# EAGLE design current_monitor_1_0_0 (EAGLE 6.1)
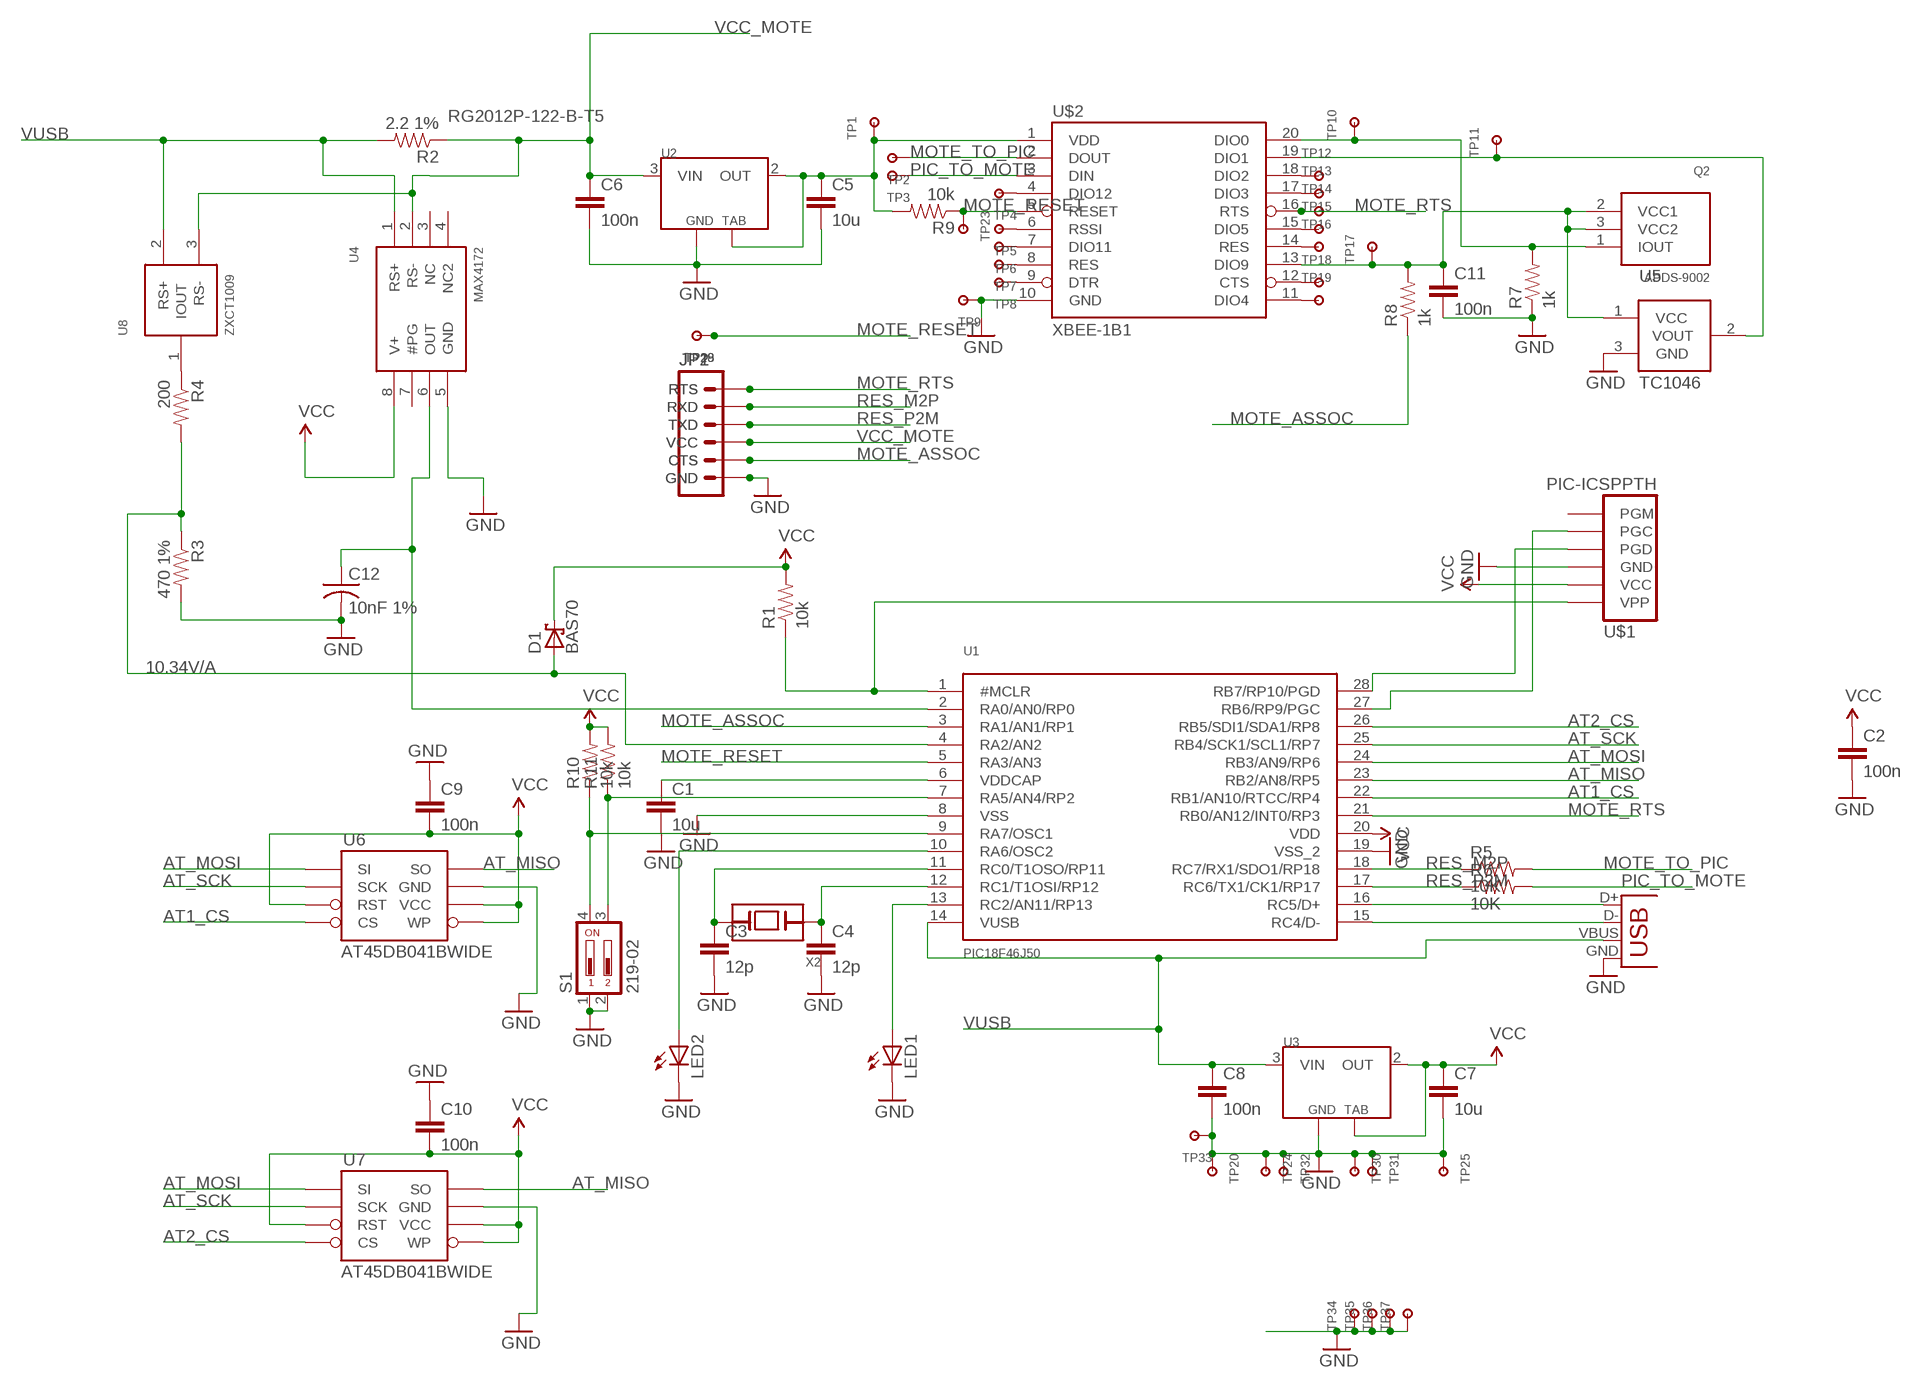
[diagram p0: schematic, sheet 1]

## Parts
C1  10u  CAP0805  [0805]
C2  100n  CAP0805  [0805]
C3  12p  CAP0805  [0805]
C4  12p  CAP0805  [0805]
C5  10u  CAP0805  [0805]
C6  100n  CAP0805  [0805]
C7  10u  CAP0805  [0805]
C8  100n  CAP0805  [0805]
C9  100n  CAP0805  [0805]
C10  100n  CAP0805  [0805]
C11  100n  CAP0805  [0805]
C12  10nF 1%  C-USC1812  [C1812]
D1  BAS70  [SOT23]
JP1  FTDI_CABLESIP  [1X06]
JP2  FTDI_CABLESIP  [1X06]
LED1  LEDCHIP-LED0805  [CHIP-LED0805]
LED2  LEDCHIP-LED0805  [CHIP-LED0805]
Q2  APDS-9002  [APDS-9002]
R1  10k  RESISTOR  [0805]
R2  2.2 1%  RESISTOR  [0805]
R3  470 1%  RESISTOR  [0805]
R4  200  RESISTOR  [0805]
R5  10K  RESISTOR  [0805]
R6  10K  RESISTOR  [0805]
R7  1k  RESISTOR  [0805]
R8  1k  RESISTOR  [0805]
R9  10k  RESISTOR  [0805]
R10  10k  RESISTOR  [0805]
R11  10k  RESISTOR  [0805]
S1  219-02  [CTS-219-02]
TP1  TESTPOINT100MIL  [TESTPOINT-100MIL]
TP2  TESTPOINT100MIL  [TESTPOINT-100MIL]
TP3  TESTPOINT100MIL  [TESTPOINT-100MIL]
TP4  TESTPOINT100MIL  [TESTPOINT-100MIL]
TP5  TESTPOINT100MIL  [TESTPOINT-100MIL]
TP6  TESTPOINT100MIL  [TESTPOINT-100MIL]
TP7  TESTPOINT100MIL  [TESTPOINT-100MIL]
TP8  TESTPOINT100MIL  [TESTPOINT-100MIL]
TP9  TESTPOINT100MIL  [TESTPOINT-100MIL]
TP10  TESTPOINT100MIL  [TESTPOINT-100MIL]
TP11  TESTPOINT100MIL  [TESTPOINT-100MIL]
TP12  TESTPOINT100MIL  [TESTPOINT-100MIL]
TP13  TESTPOINT100MIL  [TESTPOINT-100MIL]
TP14  TESTPOINT100MIL  [TESTPOINT-100MIL]
TP15  TESTPOINT100MIL  [TESTPOINT-100MIL]
TP16  TESTPOINT100MIL  [TESTPOINT-100MIL]
TP17  TESTPOINT100MIL  [TESTPOINT-100MIL]
TP18  TESTPOINT100MIL  [TESTPOINT-100MIL]
TP19  TESTPOINT100MIL  [TESTPOINT-100MIL]
TP20  TESTPOINTSMALLEST  [TESTPOINT]
TP23  TESTPOINT100MIL  [TESTPOINT-100MIL]
TP24  TESTPOINTSMALLEST  [TESTPOINT]
TP25  TESTPOINTSMALLEST  [TESTPOINT]
TP28  TESTPOINT100MIL  [TESTPOINT-100MIL]
TP29  TESTPOINT100MIL  [TESTPOINT-100MIL]
TP30  TESTPOINTSMALLEST  [TESTPOINT]
TP31  TESTPOINTSMALLEST  [TESTPOINT]
TP32  TESTPOINTSMALLEST  [TESTPOINT]
TP33  TESTPOINTSMALLEST  [TESTPOINT]
TP34  TESTPOINTM3  [M3_HOLE]
TP35  TESTPOINTM3  [M3_HOLE]
TP36  TESTPOINTM3  [M3_HOLE]
TP37  TESTPOINTM3  [M3_HOLE]
U1  PIC18F46J50  [SO28W]
U2  NX1117C  [SOT223]
U3  NX1117C  [SOT223]
U4  MAX4172  [SO08]
U5  TC1046  [SOT23]
U6  AT45DB041BWIDE  [SO08WIDE]
U7  AT45DB041BWIDE  [SO08WIDE]
U8  ZXCT1009  [SOT23]
U$1  PIC-ICSPPTH  [MOLEX-1X6]
U$2  XBEE-1B1  [XBEE-1]
X1  USBSMD  [USB-MINIB]
X2  XTALABS07  [ABS07]

## Nets
AT1_CS: U1.22(RB1/AN10/RTCC/RP4) U6.4(CS)
AT2_CS: U1.26(RB5/SDI1/SDA1/RP8) U7.4(CS)
AT_MISO: U1.23(RB2/AN8/RP5) U6.8(SO) U7.8(SO)
AT_MOSI: U1.24(RB3/AN9/RP6) U6.1(SI) U7.1(SI)
AT_SCK: U1.25(RB4/SCK1/SCL1/RP7) U6.2(SCK) U7.2(SCK)
EXTRA1: R11.1 S1.3 U1.7(RA5/AN4/RP2)
EXTRA2: R10.1 S1.4 U1.9(RA7/OSC1)
EXTRA3: LED2.A U1.10(RA6/OSC2)
GND [POWER]: C1.2 C2.2 C3.2 C4.2 C5.2 C6.2 C7.2 C8.2 C9.1 C10.1 C11.2 C12.2 JP1.1(GND) JP2.1(GND) LED1.C LED2.C R3.2 R7.1 S1.1 S1.2 TP9.2 TP20.P$1 TP24.P$1 TP25.P$1 TP30.P$1 TP31.P$1 TP32.P$1 TP33.P$1 TP34.P$1 TP35.P$1 TP36.P$1 TP37.P$1 U1.8(VSS) U1.19(VSS_2) U2.1(GND) U3.1(GND) U4.5(GND) U5.3(GND) U6.7(GND) U7.7(GND) U$1.4(GND) U$2.10(GND) X1.GND
MOTE_ASSOC: JP1.2(CTS) JP2.2(CTS) R8.1 U1.3(RA1/AN1/RP1)
MOTE_RESET: R9.1 TP23.2 TP28.2 TP29.2 U1.5(RA3/AN3) U$2.5(RESET)
MOTE_RTS: JP1.6(RTS) JP2.6(RTS) TP14.2 U1.21(RB0/AN12/INT0/RP3) U$2.16(RTS)
MOTE_TO_PIC: R5.2 TP2.2 U$2.2(DOUT)
N$1 [USB]: U1.16(RC5/D+) X1.D+
N$2 [USB]: U1.15(RC4/D-) X1.D-
N$3: LED1.A U1.13(RC2/AN11/RP13)
N$4: C1.1 U1.6(VDDCAP)
N$5: R1.1 U1.1(#MCLR) U$1.6(VPP)
N$6: C4.1 U1.12(RC1/T1OSI/RP12) X2.1(A)
N$7: C3.1 U1.11(RC0/T1OSO/RP11) X2.2(B)
N$8: U1.28(RB7/RP10/PGD) U$1.3(PGD)
N$9: U1.27(RB6/RP9/PGC) U$1.2(PGC)
N$10 [POWER]: C5.1 R9.2 TP1.2 U2.2(OUT) U2.4(TAB) U$2.1(VDD)
N$11: C12.1 U1.2(RA0/AN0/RP0) U4.6(OUT)
N$12: D1.1(A) R3.1 R4.2 U1.4(RA2/AN2)
N$13: R4.1 U8.1(IOUT)
N$15: C11.1 Q2.2(VCC1) Q2.3(VCC2) R8.2 TP17.2 U5.1(VCC) U$2.13(DIO9)
N$16: Q2.1(IOUT) R7.2 TP10.2 U$2.20(DIO0)
N$17: TP11.2 U5.2(VOUT) U$2.19(DIO1)
N$22: TP4.2 U$2.4(DIO12)
N$23: TP5.2 U$2.6(RSSI)
N$24: TP6.2 U$2.7(DIO11)
N$25: TP7.2 U$2.8(RES)
N$26: TP8.2 U$2.9(DTR)
N$27: TP12.2 U$2.18(DIO2)
N$28: TP13.2 U$2.17(DIO3)
N$30: TP15.2 U$2.15(DIO5)
N$31: TP16.2 U$2.14(RES)
N$32: TP18.2 U$2.12(CTS)
N$33: TP19.2 U$2.11(DIO4)
PIC_TO_MOTE: R6.2 TP3.2 U$2.3(DIN)
RES_M2P: JP1.5(RXD) JP2.5(RXD) R5.1 U1.18(RC7/RX1/SDO1/RP18)
RES_P2M: JP1.4(TXD) JP2.4(TXD) R6.1 U1.17(RC6/TX1/CK1/RP17)
VCC: C2.1 C7.1 C9.2 C10.2 D1.3(C) R1.2 R10.2 R11.2 U1.20(VDD) U3.2(OUT) U3.4(TAB) U4.8(V+) U6.3(RST) U6.5(WP) U6.6(VCC) U7.3(RST) U7.5(WP) U7.6(VCC) U$1.5(VCC)
VCC_MOTE [POWER]: C6.1 JP1.3(VCC) JP2.3(VCC) R2.1 U2.3(VIN) U4.2(RS-) U8.3(RS-)
VUSB [POWER]: C8.1 R2.2 U1.14(VUSB) U3.3(VIN) U4.1(RS+) U8.2(RS+) X1.VBUS
Unconnected: U4.3(NC) U4.4(NC2) U4.7(#PG) U$1.1(PGM)

## Notes on the sheet
- RG2012P-122-B-T5
- 10.34V/A

## Library data of the parts
C1-C11 = SparkFun:CAP: Capacitor Standard 0603 ceramic capacitor, and 0.1" leaded capacitor.
C12 = rcl:C-US: CAPACITOR, American symbol
D1 = diode:BAS70: Silicon Schottky Diodes General-purpose diode for high-speed switching
JP1 JP2 = custom:FTDI_CABLE: Header 6 Standard 6-pin 0.1" header. Use with straight break away headers (SKU : PRT-00116), right angle break away headers (PRT-00553), swiss pins (PRT-00743), machine pins (PRT-00117), and female headers (PRT-00115). Molex polarized connector foot print use with SKU : PRT-08094 with associated crimp pins and housings. NOTES ON THE VARIANTS LOCK and LOCK_LONGPADS... This footprint was designed to help hold the alignment of a through-hole component (i.e. 6-pin header) while soldering it into place. You may notice that each hole has been shifted either up or down by 0.005 of an inch from it's more standard position (which is a perfectly straight line). This slight alteration caused the pins (the squares in the middle) to touch the edges of the holes. Because they are alternating, it causes a "brace" to hold the component in place. 0.005 has proven to be the perfect amount of "off-center" position when using our standard breakaway headers. Although looks a little odd when you look at the bare footprint, once you have a header in there, the alteration is very hard to notice. Also, if you push a header all the way into place, it is covered up entirely on the bottom side. This idea of altering the position of holes to aid alignment will be further integrated into the Sparkfun Library for other footprints. It can help hold any component with 3 or more connection pins.
LED1 LED2 = led:LED: LED OSRAM: - CHIPLED LG R971, LG N971, LY N971, LG Q971, LY Q971, LO R971, LY R971 LH N974, LH R974 LS Q976, LO Q976, LY Q976 LO Q996 - Hyper CHIPLED LW Q18S LB Q993, LB Q99A, LB R99A - SideLED LS A670, LO A670, LY A670, LG A670, LP A670 LB A673, LV A673, LT A673, LW A673 LH A674 LY A675 LS A676, LA A676, LO A676, LY A676, LW A676 LS A679, LY A679, LG A679 - Hyper Micro SIDELED® LS Y876, LA Y876, LO Y876, LY Y876 LT Y87S - SmartLED LW L88C, LW L88S LB L89C, LB L89S, LG L890 LS L89K, LO L89K, LY L89K LS L896, LA L896, LO L896, LY L896 - TOPLED LS T670, LO T670, LY T670, LG T670, LP T670 LSG T670, LSP T670, LSY T670, LOP T670, LYG T670 LG T671, LOG T671, LSG T671 LB T673, LV T673, LT T673, LW T673 LH T674 LS T676, LA T676, LO T676, LY T676, LB T676, LH T676, LSB T676, LW T676 LB T67C, LV T67C, LT T67C, LS T67K, LO T67K, LY T67K, LW E67C LS E67B, LA E67B, LO E67B, LY E67B, LB E67C, LV E67C, LT E67C LW T67C LS T679, LY T679, LG T679 LS T770, LO T770, LY T770, LG T770, LP T770 LB T773, LV T773, LT T773, LW T773 LH T774 LS E675, LA E675, LY E675, LS T675 LS T776, LA T776, LO T776, LY T776, LB T776 LHGB T686 LT T68C, LB T68C - Hyper Mini TOPLED® LB M676 - Mini TOPLED Santana® LG M470 LS M47K, LO M47K, LY M47K Source: http://www.osram.convergy.de LUXEON: - LUMILED® LXK2-PW12-R00, LXK2-PW12-S00, LXK2-PW14-U00, LXK2-PW14-V00 LXK2-PM12-R00, LXK2-PM12-S00, LXK2-PM14-U00 LXK2-PE12-Q00, LXK2-PE12-R00, LXK2-PE12-S00, LXK2-PE14-T00, LXK2-PE14-U00 LXK2-PB12-K00, LXK2-PB12-L00, LXK2-PB12-M00, LXK2-PB14-N00, LXK2-PB14-P00, LXK2-PB14-Q00 LXK2-PR12-L00, LXK2-PR12-M00, LXK2-PR14-Q00, LXK2-PR14-R00 LXK2-PD12-Q00, LXK2-PD12-R00, LXK2-PD12-S00 LXK2-PH12-R00, LXK2-PH12-S00 LXK2-PL12-P00, LXK2-PL12-Q00, LXK2-PL12-R00 Source: www.luxeon.com KINGBRIGHT: KA-3528ASYC Source: www.kingbright.com
Q2 = WSNlib:APDS-9002: APDS-9002 Ambient Light to Current Sensor
R1-R11 = SparkFun:RESISTOR: Resistor Basic schematic elements and footprints for 0603, 1206, and PTH 1/10th watt (small) resistors.
S1 = switch-dil:219-02*: Surface Mount DIP Switch Series 219 SMT CTS Electronic Components Sourc: www.ctscorp.com
TP1-TP20 TP23-TP25 TP28-TP37 = WSNlib:TESTPOINT: Generic Testpoint
U1 = WSNlib:PIC18F46J50: PIC18F46J50 USB Microcontroller w/ RTC http://ww1.microchip.com/downloads/en/DeviceDoc/39931d.pdf
U2 U3 = WSNlib:NX1117C: NX1117C LDO Voltage regulator 1A
U4 = WSNlib:MAX4172: MAX4172 Current sense current output amplifier http://datasheets.maxim-ic.com/en/ds/MAX4172.pdf
U5 = WSNlib:TC1046: TC1046 Temperature Sensor Microchip Technologies
U6 U7 = SparkFun:AT45DB041B
U8 = WSNlib:ZXCT1009: ZXCT1009 Current Monitor (current output) http://www.diodes.com/zetex/_pdfs/3.0/pdf/ZXCT1009.pdf
U$1 = SparkFun:PIC-ICSP: ISCP Programming connector for UAV, UBW Kit, etc.
U$2 = SparkFun:XBEE-1
X1 = SparkFun:USB: USB Connectors USB-B-PTH is fully proven SKU : PRT-00139 USB-miniB is fully proven SKU : PRT-00587 USB-A-PCB is untested. USB-A-H is throughly reviewed, but untested. Spark Fun Electronics SKU : PRT-00437 USB-B-SMT is throughly reviewed, but untested. Needs silkscreen touching up. USB-A-S has not been used/tested USB-MB-H has not been used/tested
X2 = WSNlib:XTAL: Crystals used in OpenMote

## Net classes
0 default: width 0.305 mm, drill 0.33 mm, clearance 0.203 mm
1 POWER: width 0.61 mm, drill 0.508 mm, clearance 0.254 mm
2 USB: width 0.305 mm, drill 25.4 mm, clearance 0.203 mm

## Board
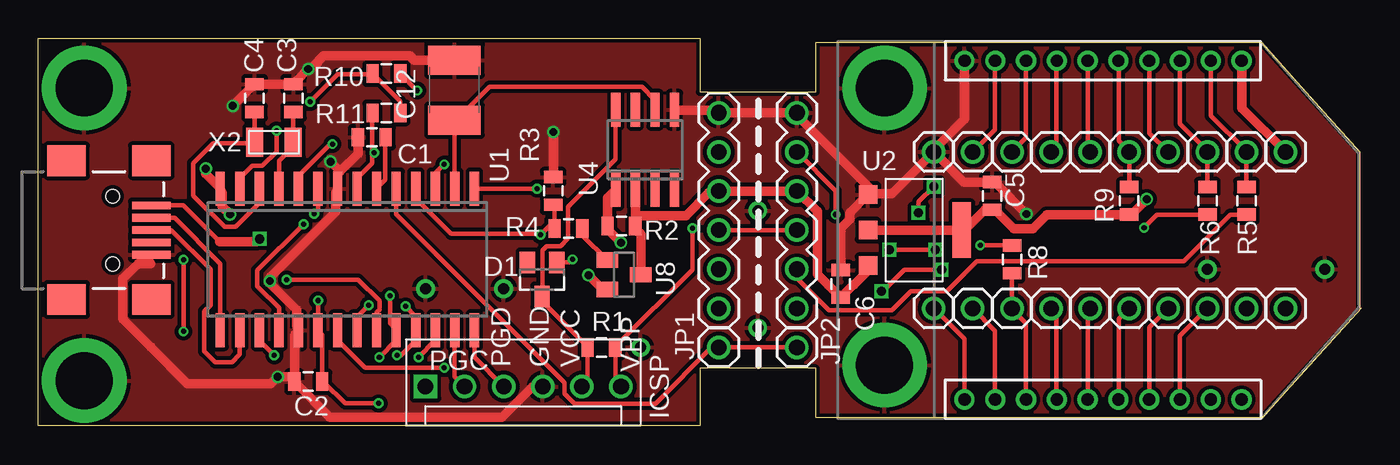
[diagram p1: board, top side]
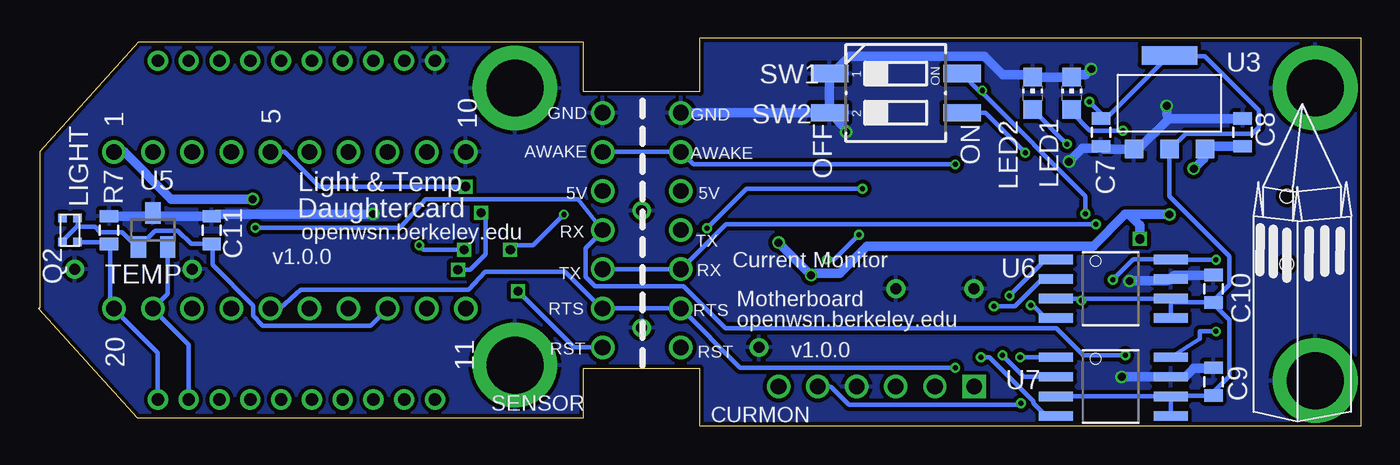
[diagram p2: board, bottom side, seen from below]

Size 85.93 x 25.15 mm. Coordinates in mm from the lower left corner, seen from the top.
Outline: 85.93,7.62 79.5,0.51 50.5,0.51 50.5,3.72 42.98,3.72 42.98,0 0,0 0,25.15 42.75,25.15 42.98,25.15 42.98,21.69 50.5,21.69 50.5,24.89 79.45,24.89 85.85,17.78 85.85,7.62 85.93,7.62
Copper layers (1*16): Top 0.035mm / dielectric 1.5mm / Bottom 0.035mm
Design rules: minimum track width 6mil, minimum drill 12mil, track to track 6mil, track to pad 6mil, pad to pad 6mil, via to via 6mil, smd to smd 0mil, copper to edge 10mil, drill to drill 10mil, minimum pad ring 10mil, minimum via ring 6mil, stop-mask expansion 2mil, vias tented up to drill 100mil, thermal gap 10mil

### Footprints (pad centres in the part's own frame; a part is rotated, then mirrored left to right if it is on the bottom)
0805 = smd 0.8 x 1.2: 1 -0.9,0; 2 0.9,0
C1812 = smd 1.9 x 3.4: 1 -1.95,0; 2 1.95,0
SOT23 = smd 1 x 1.4: 1 -0.95,-1.1; 2 0.95,-1.1; 3 0,1.1
1X06 = drill 1.016: 1 0,0; 2 2.54,0; 3 5.08,0; 4 7.62,0; 5 10.16,0; 6 12.7,0
CHIP-LED0805 = smd 1.2 x 1.2: A 0,-1.05; C 0,1.05
APDS-9002 = smd 0.55 x 0.55: 1 -0.5,0.775; 2 0.5,0.775; 3 -0.5,-0.775; 4 0.5,-0.775
CTS-219-02 = smd 1.13 x 2.44: 1 -1.27,-4.3; 2 1.27,-4.3; 3 1.27,4.3; 4 -1.27,4.3
TESTPOINT-100MIL = drill 1.016: 2 0,0
TESTPOINT = drill 0.711 pad 1.016: P$1 0,0
M3_HOLE = drill 3.7 pad 5.5: P$1 0,0
SO28W = smd 0.6 x 2.2: 1 -8.255,-4.6; 2 -6.985,-4.6; 3 -5.715,-4.6; 4 -4.445,-4.6; 5 -3.175,-4.6; 6 -1.905,-4.6; 7 -0.635,-4.6; 8 0.635,-4.6; 9 1.905,-4.6; 10 3.175,-4.6; 11 4.445,-4.6; 12 5.715,-4.6; 13 6.985,-4.6; 14 8.255,-4.6; 15 8.255,4.6; 16 6.985,4.6; 17 5.715,4.6; 18 4.445,4.6; 19 3.175,4.6; 20 1.905,4.6; 21 0.635,4.6; 22 -0.635,4.6; 23 -1.905,4.6; 24 -3.175,4.6; 25 -4.445,4.6; 26 -5.715,4.6; 27 -6.985,4.6; 28 -8.255,4.6
SOT223 = smd 1.2 x 1.2: 1 -2.3,-3; 2 0,-3; 3 2.3,-3 | smd 3.6 x 1.2: 4 0,3.1
SO08 = smd 0.6 x 2.2: 1 -1.905,-2.6; 2 -0.635,-2.6; 3 0.635,-2.6; 4 1.905,-2.6; 5 1.905,2.6; 6 0.635,2.6; 7 -0.635,2.6; 8 -1.905,2.6
SO08WIDE = smd 0.61 x 2.21: 1 -1.905,-3.569; 2 -0.635,-3.569; 3 0.635,-3.569; 4 1.905,-3.569; 5 1.905,3.886; 6 0.635,3.886; 7 -0.635,3.886; 8 -1.905,3.886
MOLEX-1X6 = drill 1.016 square: 1 0,0 | drill 1.016: 2 2.54,0; 3 5.08,0; 4 7.62,0; 5 10.16,0; 6 12.7,0
XBEE-1 = drill 0.8: 1 -11,20; 2 -11,18; 3 -11,16; 4 -11,14; 5 -11,12; 6 -11,10; 7 -11,8; 8 -11,6; 9 -11,4; 10 -11,2; 11 11,2; 12 11,4; 13 11,6; 14 11,8; 15 11,10; 16 11,12; 17 11,14; 18 11,16; 19 11,18; 20 11,20
USB-MINIB = smd 2.5 x 0.5: D+ 2.5,0; D- 2.5,0.8; GND 2.5,-1.6; ID 2.5,-0.8; VBUS 2.5,1.6 | smd 2.5 x 2: GND@1 -3,-4.5; GND@2 -3,4.5; GND@3 2.5,4.5; GND@4 2.5,-4.5 | hole 0.9: 0,2.2; 0,-2.2
ABS07 = smd 1.1 x 1.9: 1 -1.25,0; 2 1.25,0

### Placement (x,y rotation side)
C1  21.65,18.73 180 top
C2  17.53,2.86 180 top
C3  16.57,21.27 90 top
C4  14.03,21.27 90 top
C5  61.98,14.92 90 top
C6  52.13,9.21 90 top
C7  16.89,19.05 270 bottom
C8  7.68,19.05 90 bottom
C9  9.59,2.86 270 bottom
C10  9.59,8.89 270 bottom
C11  74.68,12.7 90 bottom
C12  27.03,21.79 90 top
D1  32.72,9.5 180 top
JP1  44.2,20.32 270 top
JP2  49.28,20.32 270 top
LED1  18.8,21.59 0 bottom
LED2  21.34,21.59 0 bottom
Q2  83.88,12.7 180 bottom
R1  36.58,5.08 180 top
R2  37.88,12.97 180 top
R3  33.45,15.25 90 top
R4  34.44,12.8 180 top
R5  78.49,14.61 90 top
R6  75.95,14.61 90 top
R7  81.34,12.7 270 bottom
R8  63.25,10.79 270 top
R9  70.87,14.61 270 top
R10  22.61,22.86 180 top
R11  22.61,20.32 0 top
S1  30.23,21.59 270 bottom
TP1  81.03,17.78 90 top
TP2  78.49,17.78 90 top
TP3  75.95,17.78 90 top
TP4  73.41,17.78 90 top
TP5  68.33,17.78 90 top
TP6  65.79,17.78 90 top
TP7  63.25,17.78 90 top
TP8  60.71,17.78 90 top
TP9  58.17,17.78 90 top
TP10  81.03,7.62 90 top
TP11  78.49,7.62 90 top
TP12  75.95,7.62 90 top
TP13  73.41,7.62 90 top
TP14  70.87,7.62 90 top
TP15  68.33,7.62 90 top
TP16  65.79,7.62 90 top
TP17  63.25,7.62 90 top
TP18  60.71,7.62 90 top
TP19  58.17,7.62 90 top
TP20  83.57,10.16 0 top
TP23  70.87,17.78 90 top
TP24  25.15,8.89 0 top
TP25  75.95,10.16 0 top
TP28  49.28,5.08 0 top
TP29  44.2,5.08 0 top
TP30  30.23,8.89 0 top
TP31  46.74,13.97 0 top
TP32  39.12,5.08 0 top
TP33  46.74,6.35 0 top
TP34  2.98,2.93 0 top
TP35  2.98,21.93 0 top
TP36  54.98,21.93 0 top
TP37  54.98,3.93 0 top
U1  20.07,10.79 180 top
U2  56.9,12.7 270 top
U3  12.45,20.95 0 bottom
U4  39.42,17.92 0 top
U5  78.49,12.7 0 bottom
U6  16.26,8.89 270 bottom
U7  16.26,2.54 270 bottom
U8  38.05,9.8 270 top
U$1  25.15,2.54 0 top
U$2  58.17,12.7 270 top
U$4  [SATHER_TOWER]  4.45,7.25 0 bottom
X1  4.83,12.7 0 top
X2  15.3,18.41 0 top

### Tracks (layer width: path | path; a pad name or v marks a point on that pad's centre or on a via)
AT1_CS  (via drill 0.33)
  Top 0.305: v21.46,7.82 20.7,7.06 U1.22
  Bottom 0.305: v21.46,7.82 21.31,7.82 20.47,6.98 19.84,6.98 U6.4
AT2_CS  (via drill 0.33)
  Top 0.305: v24.69,4.44 25.78,5.54 25.78,6.17 U1.26
  Bottom 0.305: v24.69,4.44 24.13,4.44 21.29,1.6 21.29,1.45 20.47,0.64 19.84,0.64 U7.4
AT_MISO  (via drill 0.33)
  Top 0.305: v16.13,9.47 20.78,9.47 22.15,8.1 22.15,7.54 21.97,7.37 U1.23 | v9.42,10.77 v9.42,6.12
  Bottom 0.305: v16.13,9.47 14.81,10.79 U6.8 12.29,10.77 v9.42,10.77 | v9.42,6.12 10.48,6.12 10.48,5.63 U7.8
AT_MOSI  (via drill 0.33)
  Top 0.305: v22.15,4.44 23.24,5.54 23.24,6.17 U1.24 23.16,6.32 22.84,6.65 v22.84,8.43
  Bottom 0.305: v22.15,4.44 19.84,4.44 U7.1 | v22.84,8.43 20.47,10.79 19.84,10.79 U6.1
AT_SCK  (via drill 0.33)
  Top 0.305: v23.85,7.75 24.51,7.09 U1.25 24.46,6.04 24.46,5.49 23.55,4.57 v23.29,4.57
  Bottom 0.305: v23.85,7.75 22.5,7.75 20.73,9.53 19.84,9.53 U6.2 | v23.29,4.57 21.89,3.18 19.84,3.18 U7.2
EXTRA1  (via drill 0.33)
  Top 0.305: 21.69,17.73 21.69,17.04 20.7,16.05 20.7,15.42 U1.7 | 21.69,17.73 21.69,20.32 R11.1 | v21.82,17.73 21.69,17.73
  Bottom 0.305: v21.82,17.73 24.41,20.32 25.91,20.32 S1.3
EXTRA2  (via drill 0.33)
  Top 0.305: v24.61,21.77 23.52,22.86 R10.1 | v17.91,13.77 18.16,14.02 U1.9
  Bottom 0.305: S1.4 25.91,22.86 24.82,21.77 v24.61,21.77 24.64,21.64 17.91,14.91 v17.91,13.77
EXTRA3  (via drill 0.33)
  Top 0.305: v19.1,18.29 18.95,18.29 16.89,16.23 16.89,15.42 U1.10
  Bottom 0.305: v19.1,18.29 21.34,20.52 LED2.A
GND  (via drill 0.51)
  Top 0.305: X1.GND 7.33,10.58 7.28,10.53
  Top 0.61: v12.62,20.78 13.82,21.97 C4.2 16.56,22.17 C3.2 16.76,22.4 v17.53,23.16 17.8,23.29 18.54,24.03 24.13,24.03 24.41,23.75 C12.2 | 19.61,16.51 19.43,16.33 19.43,15.42 U1.8 19.3,15.11 19.3,13.89 15.09,9.68 v15.04,9.4 15.04,9.25 16.76,7.52 16.76,6.48 U1.19 16.89,6.17 16.64,5.92 16.64,2.87 C2.2 | 19.61,16.51 20.75,17.65 C1.2 | C2.2 16.36,3.18 v15.55,3.18 15.1,2.73 9.68,2.73 7.28,5.13 5.48,6.93 5.48,9.53 6.48,10.53 7.28,10.53 | U$1.4 32.11,2.54 30.12,0.56 18.92,0.56 16.84,2.64 C2.2 | v18.97,17.14 19.41,16.71 19.61,16.51 | v33.45,19.07 R3.2 | U4.5 41.33,20.5 44.02,20.5 JP1.1 44.48,20.32 JP2.1 49.4,20.04 54.1,15.34 U2.1 | C6.2 52.15,12.83 52.73,13.41 52.73,13.84 53.87,14.99 U2.1 | TP9.2 60.12,15.82 C5.2 62.26,15.67 v64.19,13.74 | U$2.10 60.15,23.7 60.15,19.91 58.29,18.06 TP9.2 | U2.1 54.2,15.06 55.45,15.06 57.94,17.55 TP9.2
  Bottom 0.61: 12.5,19.94 C8.2 | 12.5,19.94 14.43,18.01 U3.1 14.76,17.96 16.71,17.96 16.89,18.14 C7.2 17.17,18.01 18.11,18.01 v18.97,17.14 | v12.62,20.78 12.62,20.22 12.5,19.94 | v17.53,23.16 17.91,22.78 18.52,22.78 LED1.C LED2.C 21.61,22.78 23.27,22.78 24.49,24 33.22,24 34.24,22.99 S1.1 34.54,22.86 34.54,20.6 S1.2 | C10.1 9.6,9.78 12.12,9.78 U6.7 12.65,9.4 v15.04,9.4 | C9.1 9.6,3.73 10.87,3.73 11.43,3.18 U7.7 12.65,3.18 v15.55,3.18 | v33.45,19.07 33.45,19.25 S1.2 | JP1.1 34.82,20.32 S1.2 | R7.1 81.33,13.61 78.72,13.61 U5.3 78.31,13.61 74.68,13.61 C11.2 74.4,13.74 v64.19,13.74
  pour Top: -0.02,25.13 42.98,25.13 42.98,21.73 50.58,21.73 50.58,24.83 79.38,24.83 85.88,17.83 85.88,7.63 79.48,0.43 50.58,0.43 50.58,3.73 42.98,3.73 42.98,-0.07 -0.02,-0.07
  pour Bottom: -0.02,25.13 42.98,25.13 42.98,21.73 50.58,21.73 50.58,24.83 79.38,24.83 85.88,17.83 85.88,7.63 79.48,0.43 50.58,0.43 50.58,3.73 42.98,3.73 42.98,-0.07 -0.02,-0.07
MOTE_ASSOC  (via drill 0.33, 0.6)
  Top 0.305: v61.19,11.71 R8.1 | v51.79,13.72 51.79,15.27 JP2.2 | v26.36,16.97 25.78,16.38 25.78,15.42 U1.3 | v55.28,11.43 v58.28,11.43
  Bottom 0.305: v51.79,13.72 53.8,11.71 55,11.71 v55.28,11.43 | v26.36,16.97 43.38,16.97 JP1.2 44.32,17.78 JP2.2 | v58.28,11.43 60.91,11.43 v61.19,11.71
MOTE_RESET  (via drill 0.6)
  Top 0.305: R9.1 TP23.2 70.79,17.91 70.18,18.52 70.18,23.7 U$2.5 | U1.5 23.24,13.74 34.19,2.79 34.19,2.06 34.82,1.42 40.08,1.42 43.74,5.08 TP29.2 44.32,5.08 48.16,5.08 TP28.2 | v54.78,8.73 54.88,8.73 56.28,10.13 v58.68,10.13 | v57.18,13.83 57.18,14.53 v58.18,15.53
  Bottom 0.305: TP23.2 69.93,17.78 67.68,15.53 65.5,15.53 v58.18,15.53 | TP28.2 51.13,5.08 v54.78,8.73 | v58.68,10.13 57.88,10.13 56.88,11.13 56.88,13.33 v57.18,13.83
MOTE_RTS  (via drill 0.33)
  Top 0.305: TP14.2 70.18,6.93 70.18,1.7 U$2.16 | v26.36,3.76 21.21,3.76 19.43,5.54 19.43,6.17 U1.21
  Bottom 0.305: v26.36,3.76 40.34,3.76 JP1.6 44.32,7.62 JP2.6 49.4,7.7 51.71,10.01 56.9,10.01 57.98,8.83 68.91,8.84 70.23,7.62 TP14.2
MOTE_TO_PIC
  Top 0.305: R5.2 TP2.2 78.41,17.91 76.17,20.14 U$2.2
N$1
  Top 0.305: X1.D+ 8.64,12.7 11.18,10.16 11.18,7.83 10.78,7.43 10.78,4.83 11.48,4.13 12.58,4.13 13.08,4.63 U1.16
N$2
  Top 0.305: U1.15 11.81,10.52 8.84,13.49 7.34,13.49 X1.D-
N$3  (via drill 0.33)
  Top 0.305: v15.47,19.15 15.47,17.8 14.53,16.87 13.89,16.87 13.08,16.05 13.08,15.42 U1.13
  Bottom 0.305: v15.47,19.15 17.6,19.15 18.8,20.34 18.8,20.52 LED1.A
N$4
  Top 0.305: C1.1 22.53,18.72 22.53,15.98 21.97,15.42 U1.6
N$5  (via drill 0.33)
  Top 0.305: U$1.6 37.49,2.9 37.49,5.08 R1.1 37.57,5.21 42.49,10.13 v42.49,12.83 | v32.38,15.39 U1.1
  Bottom 0.305: v32.38,15.39 39.93,15.39 v42.49,12.83
N$6
  Top 0.305: C4.1 X2.1 13.92,18.34 11.35,18.34 10.06,17.04 10.06,14.94 12.09,12.9 12.8,12.9 14.35,14.45 U1.12
N$7
  Top 0.305: C3.1 16.56,20.37 X2.2 16.48,18.29 16.48,18.09 15.62,17.22 15.62,15.42 U1.11
N$8
  Top 0.305: U$1.3 28.32,4.44 28.32,6.17 U1.28
N$9
  Top 0.305: U$1.2 27.05,3.18 27.05,6.17 U1.27
N$10  (via drill 0.51)
  Top 0.61: TP1.2 78.18,20.62 78.18,23.7 U$2.1 | U2.2 U2.4 60.3,12.83 61.49,14.02 C5.1 62.26,13.89 63.37,12.78 64.59,12.78 65.51,13.69 70.87,13.69 R9.2 71.14,13.84 v72.01,14.71
  Bottom 0.61: TP1.2 80.37,17.78 77.29,14.71 v72.01,14.71
N$11
  Top 0.305: U1.2 27.05,15.42 27.05,19.84 C12.1 27.2,19.89 29.31,22 39.22,22 40.03,21.18 40.03,20.52 U4.6
N$12  (via drill 0.33)
  Top 0.305: R3.1 33.45,14.33 33.53,14.25 R4.2 33.4,13.18 v32.61,12.39 32.49,12.47 26.8,12.47 24.51,14.76 U1.4 | v34.7,10.79 34.52,10.62 33.68,10.62 D1.1
  Bottom 0.305: v34.7,10.79 34.21,10.79 v32.61,12.39
N$13
  Top 0.305: R4.1 35.36,12.78 35.36,12.34 36.93,10.77 U8.1
N$15
  Top 0.305: R8.2 TP17.2 63.32,7.49 64.16,6.65 U$2.13
  Bottom 0.305: 83.39,12.98 Q2.3 | 83.39,12.98 84.38,11.99 84.38,11.94 Q2.2 | 83.39,12.98 83.26,12.9 82.25,12.9 81.91,12.57 80.49,12.57 79.58,11.66 U5.1 78.36,12.67 76.89,12.67 76.02,11.81 74.68,11.81 C11.1 74.62,11.66 74.62,10.44 71.98,7.8 71.98,7.14 71.35,6.5 64.36,6.5 TP17.2
N$16
  Bottom 0.305: Q2.1 83.36,11.91 81.46,11.91 81.36,11.81 R7.2 81.28,11.66 81.28,7.87 TP10.2 80.95,7.49 78.18,4.72 78.18,1.7 U$2.20
N$17
  Bottom 0.305: U5.2 77.55,11.58 77.55,8.56 TP11.2 78.41,7.49 76.17,5.26 U$2.19
N$22
  Top 0.305: TP4.2 72.19,19 72.19,23.7 U$2.4
N$23
  Top 0.305: TP5.2 68.17,17.93 U$2.6
N$24
  Top 0.305: TP6.2 66.14,18.14 66.14,23.7 U$2.7
N$25
  Top 0.305: TP7.2 64.16,18.69 U$2.8
N$26
  Top 0.305: TP8.2 62.15,19.23 62.15,23.7 U$2.9
N$27
  Top 0.305: TP12.2 74.17,5.84 U$2.18
N$28
  Top 0.305: TP13.2 72.19,6.4 72.19,1.7 U$2.17
N$30
  Top 0.305: TP15.2 68.17,7.47 U$2.15
N$31
  Top 0.305: TP16.2 66.14,7.26 66.14,1.7 U$2.14
N$32
  Top 0.305: TP18.2 62.15,6.17 62.15,1.7 U$2.12
N$33
  Top 0.305: TP19.2 60.15,5.64 60.15,1.7 U$2.11
PIC_TO_MOTE
  Top 0.305: R6.2 TP3.2 75.87,17.91 74.17,19.61 U$2.3
RES_M2P  (via drill 0.33)
  Top 0.305: JP2.5 49.28,9.58 51.36,7.49 55.45,7.49 56.69,8.74 59.03,8.74 60.96,10.67 74.42,10.67 77.44,13.69 78.49,13.69 R5.1 | v17.22,13.08 14.22,10.08 14.22,9.04 15.62,7.64 U1.18
  Bottom 0.305: v17.22,13.08 41.27,13.08 JP1.5 44.32,10.16 JP2.5
RES_P2M  (via drill 0.33)
  Top 0.305: v71.83,12.85 72.67,13.69 75.95,13.69 R6.1 | v15.32,4.57 14.35,5.54 14.35,6.17 U1.17 | JP2.4 JP1.4
  Bottom 0.305: v71.83,12.85 62.42,12.85 60.77,14.7 50.88,14.7 JP2.4 49.35,12.57 50.39,11.53 50.39,9.68 49.76,9.04 44.02,9.04 41.3,6.32 19.79,6.32 18.03,4.57 v15.32,4.57
VCC  (via drill 0.33)
  Top 0.305: U$1.5 35.66,2.9 35.66,5.08 R1.2 35.59,5.21 32.74,8.05 32.74,8.38 D1.3 32.77,8.53 32.77,11.4 33.02,11.66 33.91,11.66 34.42,12.17 34.42,14.22 37.49,17.3 37.49,20.5 U4.8 | R11.2 23.49,20.32 23.49,21.08 R10.2 21.56,22.81 19.43,22.81 v17.65,21.03 | v18.16,8.13 18.16,6.32 U1.20 18.16,6.17 18.41,5.92 C2.1 18.57,2.79 19.91,1.45 v22.1,1.45
  Bottom 0.305: v17.65,21.03 16.71,20.09 C7.1 16.89,19.96 16.54,19.96 U3.4 12.32,23.98 10.14,23.98 6.66,20.5 6.66,19.38 7.06,18.97 11.38,18.97 12.32,18.03 U3.2 12.45,17.93 12.45,14.88 8.56,11 8.56,9.14 9.55,8.15 C10.2 | U7.6 12.32,1.96 9.6,1.96 C9.2 9.55,2.11 9.55,2.21 8.56,3.2 8.56,6.88 9.53,7.85 C10.2 | U7.5 12.37,1.78 U7.6 | U7.3 19.81,1.91 12.5,1.91 U7.6 | U6.6 12.12,8 9.6,8 C10.2 | U6.5 12.37,8.05 U6.6 | 18.16,8.25 12.5,8.25 U6.6 | 18.16,8.25 19.81,8.25 U6.3 | v18.16,8.13 18.16,8.25 | U$1.5 34.44,2.54 33.27,1.37 22.17,1.37 v22.1,1.45
VCC_MOTE
  Top 0.61: 38.79,13.64 U4.2 | 38.79,13.64 R2.1 38.89,12.67 39.14,12.42 U8.3 | U2.3 53.87,10.39 53.87,10.03 52.98,9.14 52.96,9.14 52.15,8.33 C6.1 51.92,8.53 51.31,9.14 51.28,9.14 50.6,9.83 50.6,13.92 JP2.3 49,15.24 JP1.3 43.92,15.11 43.54,15.11 42.06,13.64 39.06,13.64 38.79,13.64
VUSB  (via drill 0.51, 0.6)
  Top 0.305: X1.VBUS 9.41,14.3 11.78,11.93
  Top 0.61: v10.87,16.69 10.87,16.36 11.81,15.42 U1.14 11.94,15.11 11.94,14.22 v12.45,13.72 | U4.1 37.49,15.32 36.98,14.81 R2.2 37.03,12.7 v37.85,11.89 | v35.74,9.78 36.65,8.87 36.93,8.87 U8.2 | 11.78,11.93 14.18,11.93 v14.38,12.13
  Bottom 0.61: C8.1 7.7,18.14 9.96,18.14 U3.3 10.21,17.65 10.21,17.35 v10.87,16.69 | v37.85,11.89 v35.74,9.78 35.46,9.91 33.86,9.91 32.11,11.66 17.4,11.66 15.34,13.72 15.08,13.72 | 15.08,13.72 v12.45,13.72 | v14.38,12.13 14.38,13.02 15.08,13.72

### Text on the board
tPlace: PGC | PGD | GND | VCC | VPP | ICSP
bPlace: SW1 | GND | GND | SW2 | 5 | 10 | 1 | AWAKE | AWAKE | ON | Light & Temp | OFF | 5V | 5V | Daughtercard | LIGHT | RX | openwsn.berkeley.edu | TX | v1.0.0 | RX | TEMP | Current Monitor | TX | Motherboard | RTS | RTS | v1.0.0 | openwsn.berkeley.edu | RST | 11 | 20 | RST | SENSOR | CURMON